# Altium schematic sheet CM5_HighSpeed.SchDoc
size 420 x 297 mm; Organization: Q-Wave Systems Co.,Ltd; Address1: No.1; Address2: Suksawat 33/1; Address3: Ratburana; Address4: Bangkok Thailand
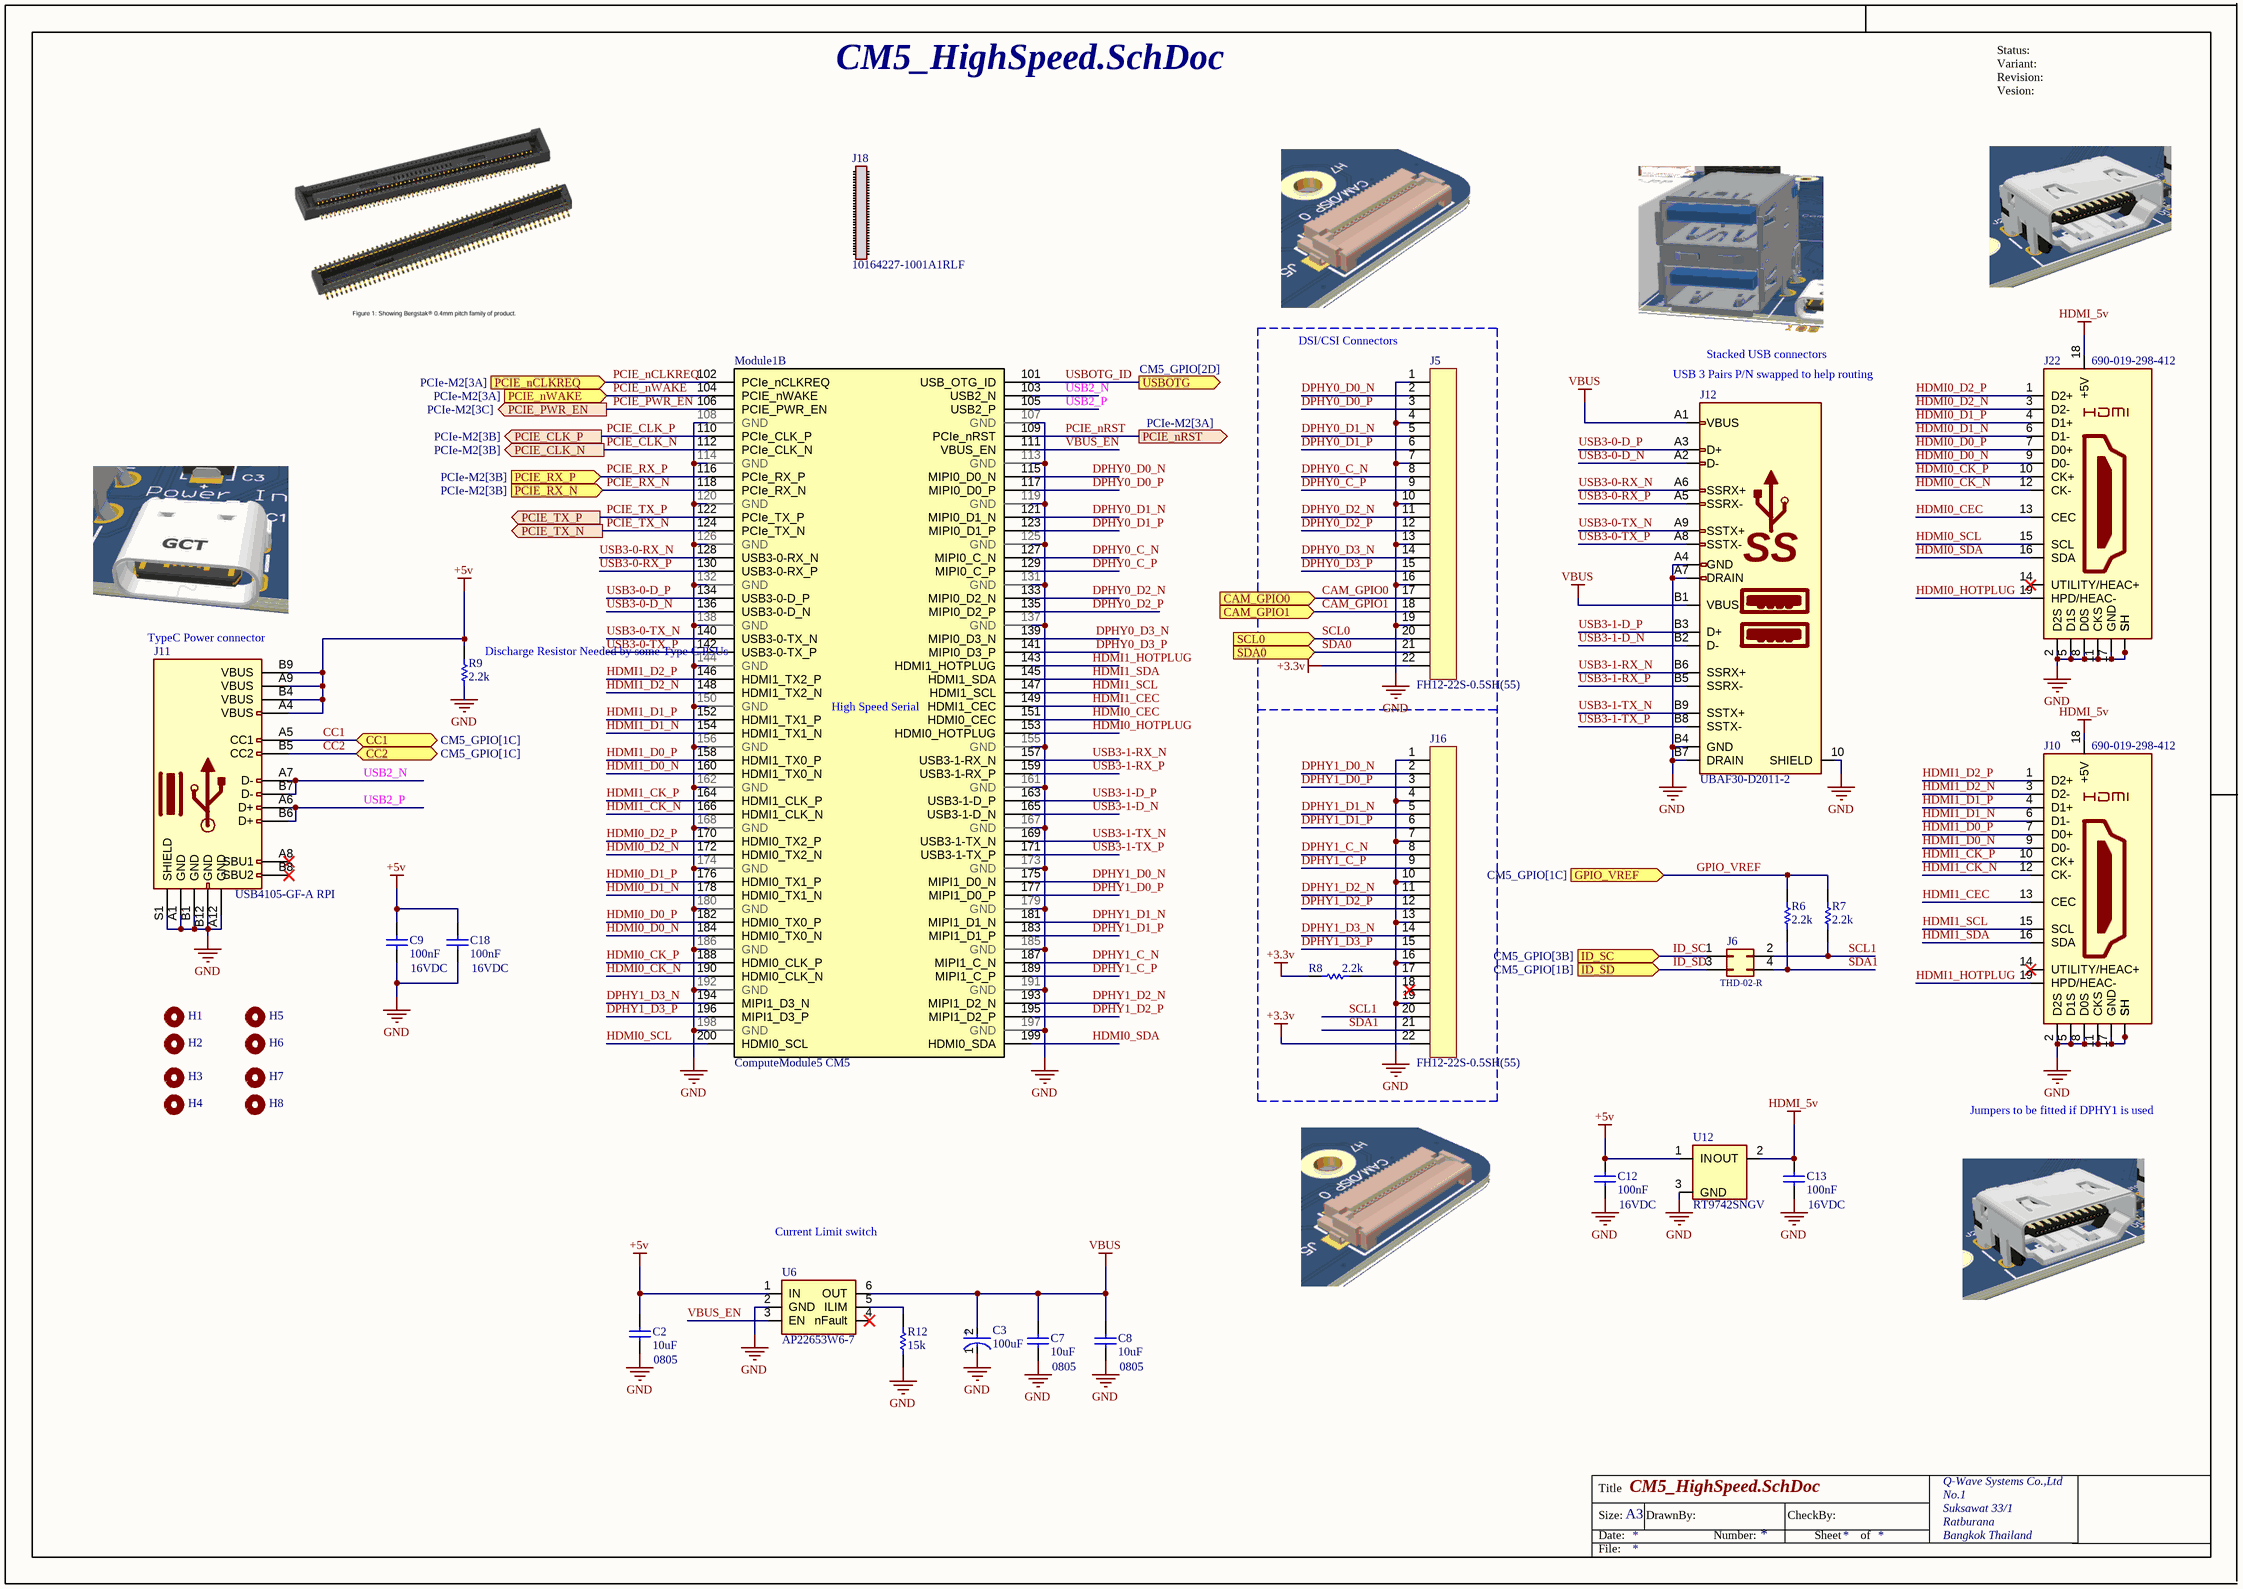
[diagram p0: CM5_HighSpeed.SchDoc]

## Parts
C2  value 10uF  Size: 0805  [WCAP-CSGP_0805_H=1.25mm]  (hidden comment: 10uF, 16V)
C3  value 100uF  [FP-CX-MFG]  (hidden comment: EEF-CX0J101R)
C7  value 10uF  Size: 0805  [WCAP-CSGP_0805_H=1.25mm]  (hidden comment: 10uF, 16V)
C8  value 10uF  Size: 0805  [WCAP-CSGP_0805_H=1.25mm]  (hidden comment: 10uF, 16V)
C9  value 100nF  Rated Voltage: 16VDC  [WCAP-CSGP_0402_H=0.5mm]  (hidden comment: 100nF, 16V)
C12  value 100nF  Rated Voltage: 16VDC  [WCAP-CSGP_0402_H=0.5mm]  (hidden comment: 100nF, 16V)
C13  value 100nF  Rated Voltage: 16VDC  [WCAP-CSGP_0402_H=0.5mm]  (hidden comment: 100nF, 16V)
C18  value 100nF  Rated Voltage: 16VDC  [WCAP-CSGP_0402_H=0.5mm]  (hidden comment: 100nF, 16V)
H1  MountingHole CMIO  [MountingHole CMIO]  (value not drawn)  (no BOM)
H2  MountingHole CMIO  [MountingHole CMIO]  (value not drawn)  (no BOM)
H3  MountingHole CMIO  [MountingHole CMIO]  (value not drawn)  (no BOM)
H4  MountingHole CMIO  [MountingHole CMIO]  (value not drawn)  (no BOM)
H5  MountingHole CMIO  [MountingHole CMIO]  (value not drawn)  (no BOM)
H6  MountingHole CMIO  [MountingHole CMIO]  (value not drawn)  (no BOM)
H7  MountingHole CMIO  [MountingHole CMIO]  (value not drawn)  (no BOM)
H8  MountingHole CMIO  [MountingHole CMIO]  (value not drawn)  (no BOM)
J5  FH12-22S-0.5SH(55)  [FH12-22S-0.5SH(55)]
J6  THD-02-R  [THD-02-R]
J10  690-019-298-412  [690-019-298-412]
J11  USB4105-GF-A RPI  [USB4105-GF-A RPI]
J12  UBAF30-D2011-2  [UBAF30-D2011-2]
J16  FH12-22S-0.5SH(55)  [FH12-22S-0.5SH(55)]
J18  10164227-1001A1RLF  [CM5-BergStak-10164227]
J22  690-019-298-412  [690-019-298-412]
Module1  ComputeModule5 CM5  [ComputeModule5-CM5]  (part B of 2)  (no BOM)
R6  value 2.2k  [SMD-0402-RES]  (hidden comment: RES SMD 2.2K OHM 1% 1/10W 0402)
R7  value 2.2k  [SMD-0402-RES]  (hidden comment: RES SMD 2.2K OHM 1% 1/10W 0402)
R8  value 2.2k  [SMD-0402-RES]  (hidden comment: RES SMD 2.2K OHM 1% 1/10W 0402)
R9  value 2.2k  [SMD-0402-RES]  (hidden comment: RES SMD 2.2K OHM 1% 1/10W 0402)
R12  value 15k  [SMD-0402-RES]  (hidden comment: RES SMD 15K OHM 1% 1/10W 0402)
U6  AP22653W6-7  [FP-SOT26-IPC_A]
U12  RT9742SNGV  [RT9742SNGV]

## Ports
CAM_GPIO0 (in, see CM5_GPIO[3C]), CAM_GPIO1 (in, see CM5_GPIO[1C]), CC1 (bidir, see CM5_GPIO[1C]), CC2 (bidir, see CM5_GPIO[1C]), GPIO_VREF (in, see CM5_GPIO[1C]), ID_SC (in, see CM5_GPIO[3B]), ID_SD (in, see CM5_GPIO[1B]), PCIE_CLK_N (out, see PCIe-M2[3B]), PCIE_CLK_P (out, see PCIe-M2[3B]), PCIE_nCLKREQ (in, see PCIe-M2[3A]), PCIE_nRST (out, see PCIe-M2[3A]), PCIE_nWAKE (in, see PCIe-M2[3A]), PCIE_PWR_EN (out, see PCIe-M2[3C]), PCIE_RX_N (in, see PCIe-M2[3B]), PCIE_RX_P (in, see PCIe-M2[3B]), PCIE_TX_N (out, see PCIe-M2[3A]), PCIE_TX_P (out, see PCIe-M2[3A]), SCL0 (in, see CM5_GPIO[1C]), SDA0 (in, see CM5_GPIO[1C]), USBOTG (out, see CM5_GPIO[2D])

## Nets
+3.3v: J5.22(Pin_22) J16.22(Pin_22) R8.1
+5v: C2.2 C9.2 C12.2 C18.2 J11.A4(VBUS) J11.A9(VBUS) J11.B4(VBUS) J11.B9(VBUS) R9.2 U6.1(IN) U12.1(IN)
GND: C2.1 C3.1(C) C7.1 C8.1 C9.1 C12.1 C13.1 C18.1 J5.1(Pin_1) J5.4(Pin_4) J5.7(Pin_7) J5.10(Pin_10) J5.13(Pin_13) J5.16(Pin_16) J5.19(Pin_19) J10.2(D2S) J10.5(D1S) J10.8(D0S) J10.11(CKS) J10.17(GND) J10.SH1(SH) J10.SH2(SH) J10.SH3(SH) J10.SH4(SH) J11.A1(GND) J11.A12(GND) J11.B1(GND) J11.B12(GND) J11.S1(SHIELD) J12.10(SHIELD) J12.A4(GND) J12.A7(DRAIN) J12.B4(GND) J12.B7(DRAIN) J16.1(Pin_1) J16.4(Pin_4) J16.7(Pin_7) J16.10(Pin_10) J16.13(Pin_13) J16.16(Pin_16) J16.19(Pin_19) J22.2(D2S) J22.5(D1S) J22.8(D0S) J22.11(CKS) J22.17(GND) J22.SH1(SH) J22.SH2(SH) J22.SH3(SH) J22.SH4(SH) Module1.107(GND) Module1.108(GND) Module1.113(GND) Module1.114(GND) Module1.119(GND) Module1.120(GND) Module1.125(GND) Module1.126(GND) Module1.131(GND) Module1.132(GND) Module1.137(GND) Module1.138(GND) Module1.144(GND) Module1.150(GND) Module1.155(GND) Module1.156(GND) Module1.161(GND) Module1.162(GND) Module1.167(GND) Module1.168(GND) Module1.173(GND) Module1.174(GND) Module1.179(GND) Module1.180(GND) Module1.185(GND) Module1.186(GND) Module1.191(GND) Module1.192(GND) Module1.197(GND) Module1.198(GND) R9.1 R12.2 U6.2(GND) U12.3(GND)
HDMI_5v: C13.2 J10.18(+5V) J22.18(+5V) U12.2(OUT)
VBUS: C3.2(A) C7.2 C8.2 J12.A1(VBUS) J12.B1(VBUS) U6.6(OUT)
CAM_GPIO0: J5.17(Pin_17) ; port CAM_GPIO0
CAM_GPIO1: J5.18(Pin_18) ; port CAM_GPIO1
CC1: J11.A5(CC1) ; port CC1
CC2: J11.B5(CC2) ; port CC2
DPHY0_C_N: J5.8(Pin_8) Module1.127(MIPI0_C_N)
DPHY0_C_P: J5.9(Pin_9) Module1.129(MIPI0_C_P)
DPHY0_D0_N: J5.2(Pin_2) Module1.115(MIPI0_D0_N)
DPHY0_D0_P: J5.3(Pin_3) Module1.117(MIPI0_D0_P)
DPHY0_D1_N: J5.5(Pin_5) Module1.121(MIPI0_D1_N)
DPHY0_D1_P: J5.6(Pin_6) Module1.123(MIPI0_D1_P)
DPHY0_D2_N: J5.11(Pin_11) Module1.133(MIPI0_D2_N)
DPHY0_D2_P: J5.12(Pin_12) Module1.135(MIPI0_D2_P)
DPHY0_D3_N: J5.14(Pin_14) Module1.139(MIPI0_D3_N)
DPHY0_D3_P: J5.15(Pin_15) Module1.141(MIPI0_D3_P)
DPHY1_C_N: J16.8(Pin_8) Module1.187(MIPI1_C_N)
DPHY1_C_P: J16.9(Pin_9) Module1.189(MIPI1_C_P)
DPHY1_D0_N: J16.2(Pin_2) Module1.175(MIPI1_D0_N)
DPHY1_D0_P: J16.3(Pin_3) Module1.177(MIPI1_D0_P)
DPHY1_D1_N: J16.5(Pin_5) Module1.181(MIPI1_D1_N)
DPHY1_D1_P: J16.6(Pin_6) Module1.183(MIPI1_D1_P)
DPHY1_D2_N: J16.11(Pin_11) Module1.193(MIPI1_D2_N)
DPHY1_D2_P: J16.12(Pin_12) Module1.195(MIPI1_D2_P)
DPHY1_D3_N: J16.14(Pin_14) Module1.194(MIPI1_D3_N)
DPHY1_D3_P: J16.15(Pin_15) Module1.196(MIPI1_D3_P)
GPIO_VREF: R6.2 R7.2 ; port GPIO_VREF
HDMI0_CEC: J22.13(CEC) Module1.151(HDMI0_CEC)
HDMI0_CK_N: J22.12(CK-) Module1.190(HDMI0_CLK_N)
HDMI0_CK_P: J22.10(CK+) Module1.188(HDMI0_CLK_P)
HDMI0_D0_N: J22.9(D0-) Module1.184(HDMI0_TX0_N)
HDMI0_D0_P: J22.7(D0+) Module1.182(HDMI0_TX0_P)
HDMI0_D1_N: J22.6(D1-) Module1.178(HDMI0_TX1_N)
HDMI0_D1_P: J22.4(D1+) Module1.176(HDMI0_TX1_P)
HDMI0_D2_N: J22.3(D2-) Module1.172(HDMI0_TX2_N)
HDMI0_D2_P: J22.1(D2+) Module1.170(HDMI0_TX2_P)
HDMI0_HOTPLUG: J22.19(HPD/HEAC-) Module1.153(HDMI0_HOTPLUG)
HDMI0_SCL: J22.15(SCL) Module1.200(HDMI0_SCL)
HDMI0_SDA: J22.16(SDA) Module1.199(HDMI0_SDA)
HDMI1_CEC: J10.13(CEC) Module1.149(HDMI1_CEC)
HDMI1_CK_N: J10.12(CK-) Module1.166(HDMI1_CLK_N)
HDMI1_CK_P: J10.10(CK+) Module1.164(HDMI1_CLK_P)
HDMI1_D0_N: J10.9(D0-) Module1.160(HDMI1_TX0_N)
HDMI1_D0_P: J10.7(D0+) Module1.158(HDMI1_TX0_P)
HDMI1_D1_N: J10.6(D1-) Module1.154(HDMI1_TX1_N)
HDMI1_D1_P: J10.4(D1+) Module1.152(HDMI1_TX1_P)
HDMI1_D2_N: J10.3(D2-) Module1.148(HDMI1_TX2_N)
HDMI1_D2_P: J10.1(D2+) Module1.146(HDMI1_TX2_P)
HDMI1_HOTPLUG: J10.19(HPD/HEAC-) Module1.143(HDMI1_HOTPLUG)
HDMI1_SCL: J10.15(SCL) Module1.147(HDMI1_SCL)
HDMI1_SDA: J10.16(SDA) Module1.145(HDMI1_SDA)
ID_SC: J6.1(Pin_1) ; port ID_SC
ID_SD: J6.3(Pin_3) ; port ID_SD
PCIE_CLK_N: Module1.112(PCIe_CLK_N) ; port PCIE_CLK_N
PCIE_CLK_P: Module1.110(PCIe_CLK_P) ; port PCIE_CLK_P
PCIE_nCLKREQ: Module1.102(PCIe_nCLKREQ) ; port PCIE_nCLKREQ
PCIE_nRST: Module1.109(PCIe_nRST) ; port PCIE_nRST
PCIE_nWAKE: Module1.104(PCIE_nWAKE) ; port PCIE_nWAKE
PCIE_PWR_EN: Module1.106(PCIE_PWR_EN) ; port PCIE_PWR_EN
PCIE_RX_N: Module1.118(PCIe_RX_N) ; port PCIE_RX_N
PCIE_RX_P: Module1.116(PCIe_RX_P) ; port PCIE_RX_P
PCIE_TX_N: Module1.124(PCIe_TX_N) ; port PCIE_TX_N
PCIE_TX_P: Module1.122(PCIe_TX_P) ; port PCIE_TX_P
SCL0: J5.20(Pin_20) ; port SCL0
SCL1: J6.2(Pin_2) J16.20(Pin_20) R7.1
SDA0: J5.21(Pin_21) ; port SDA0
SDA1: J6.4(Pin_4) J16.21(Pin_21) R6.1
USB2_N: J11.A7(D-) J11.B7(D-) Module1.103(USB2_N)
USB2_P: J11.A6(D+) J11.B6(D+) Module1.105(USB2_P)
USB3-0-D_N: J12.A2(D-) Module1.136(USB3-0-D_N)
USB3-0-D_P: J12.A3(D+) Module1.134(USB3-0-D_P)
USB3-0-RX_N: J12.A6(SSRX+) Module1.128(USB3-0-RX_N)
USB3-0-RX_P: J12.A5(SSRX-) Module1.130(USB3-0-RX_P)
USB3-0-TX_N: J12.A9(SSTX+) Module1.140(USB3-0-TX_N)
USB3-0-TX_P: J12.A8(SSTX-) Module1.142(USB3-0-TX_P)
USB3-1-D_N: J12.B2(D-) Module1.165(USB3-1-D_N)
USB3-1-D_P: J12.B3(D+) Module1.163(USB3-1-D_P)
USB3-1-RX_N: J12.B6(SSRX+) Module1.157(USB3-1-RX_N)
USB3-1-RX_P: J12.B5(SSRX-) Module1.159(USB3-1-RX_P)
USB3-1-TX_N: J12.B9(SSTX+) Module1.169(USB3-1-TX_N)
USB3-1-TX_P: J12.B8(SSTX-) Module1.171(USB3-1-TX_P)
USBOTG_ID: Module1.101(USB_OTG_ID) ; port USBOTG
VBUS_EN: Module1.111(VBUS_EN) U6.3(EN)
NetJ16_17: J16.17(Pin_17) R8.2
NetR12_1: R12.1 U6.5(ILIM)

Not connected (* = marked no-connect by the designer): J10 14(UTILITY/HEAC+)*; J11 A8(SBU1)* B8(SBU2)*; J16 18(Pin_18)*; J22 14(UTILITY/HEAC+)*; U6 4(nFault)*

## Notes on the sheet
- (near J5) DSI/CSI Connectors
- (near J12) USB 3 Pairs P/N swapped to help routing
- Stacked USB connectors
- (near J11) TypeC Power connector
- (near Module1) Discharge Resistor
  Needed by some
  Type C PSUs
- Jumpers to be fitted if DPHY1 is used
- Current Limit switch
- Status:
- Revision:
- Variant:
- Vesion:
- Title
- Size:
- Date:
- A3
- DrawnBy:
- Number:
- CheckBy:
- Sheet
- of
- File:
- (in symbol CMP-002-00176-3) SS
- (in symbol CMP-000464-1) +
- (in symbol CMP-633-000139-6, part B) High Speed Serial

## Library data of the parts
C2 C7 C8 = CMP-01449-2: WCAP-CSGP Multilayer Ceramic Chip Capacitor, General Purpose, size 0805, X5R, 10uF, 16V; Manufacturer: Wurth Elektronik; Manufacturer Part Number: 885012107014; Isolation Resistance  min.: 0.01GOhm; Dissipation Factor max.: 10%; Capacitance Tolerance: +/-20%; Technical Reference: X5R0805106M016DFCT10000; Rated Voltage: 16VDC; Packaging: Tape and Reel; ComponentLink2URL: https://www.we-online.com/catalog/datasheet/885012107014.pdf; Height: 1.25mm; Source: WCAP-CSGP_0805.SchLib; Design Item ID: 885012107014; ComponentLink2Description: Datasheet; Pin Count: 2; Capacitance: 10uF; ComponentLink1URL: http://www.we-online.de; Operating Temperature: -55 to +85degC; Published Date: April 2021; Mounting Technology: SMT; Ceramic Type: X5R; ComponentLink1Description: Manufacturer; Component Type: Standard; Q-Factor min.: -
C3 = CMP-000464-1: Cap Aluminum 100uF 6.3V 20% (7.3 X 4.3 X 1.9mm) SMD 0.015 Ohm 2700mA 1000h 105C Embossed T/R; Leakage Current: 63uA; Lead Diameter: 2.4mm; Life (Hours): 1000Hour; Dissipation Factor: 0.06%; Ripple Current: 2.7A; ESR (Equivalent Series Resistance): 15mR; Max Operating Temperature: 105°C; Lead Free: Lead Free; RoHS Compliant: Yes; Voltage Rating: 6.3V; Depth: 4.3mm; Reach SVHC Compliant: No; Package Quantity: 3500; Tolerance: 20%; Construction: Flat; Length: 7.3mm; Pins: 2; Width: 4.3mm; Case/Package: 2917; Height: 1.9mm; Packaging: Tape and Reel; Lead Pitch: 1.3mm; Mounting Technology: Surface Mount,PCB; Voltage: 6.3V; Termination: SMD/SMT; Ripple Current (AC): 2.7A; Weight: 0.004586oz; Case Code (Metric): 7343; Radiation Hardening: No; Voltage Rating (DC): 6.3V; Series: SP-Cap CX; Min Operating Temperature: -40°C; Case Code (Imperial): 2917
C9 C12 C13 C18 = CMP-01409-2: WCAP-CSGP Multilayer Ceramic Chip Capacitor, General Purpose, size 0402, X5R, 100nF, 16V; Manufacturer Part Number: 885012105016; Manufacturer: Wurth Elektronik; Technical Reference: X5R0402104M016DFCT10000; Isolation Resistance  min.: 5GOhm; Dissipation Factor max.: 5%; Capacitance Tolerance: +/-20%; Published Date: April 2021; Height: 0.5mm; Operating Temperature: -55 to +85degC; Source: WCAP-CSGP_0402.SchLib; Packaging: Tape and Reel; Q-Factor min.: -; Component Type: Standard; Capacitance: 100nF; Ceramic Type: X5R; ComponentLink1Description: Manufacturer; ComponentLink1URL: http://www.we-online.de; ComponentLink2URL: https://www.we-online.com/catalog/datasheet/885012105016.pdf; Pin Count: 2; Size: 0402; Mounting Technology: SMT; Design Item ID: 885012105016; ComponentLink2Description: Datasheet
H1-H8 = CMP-00028-00023-1
J5 J16 = CMP-002-00175-3: Connectors for Connecting - 0.5/1-mm Pitch FPC/FFC - FH12 Series (HIROSE ELECTRIC); Mating Cycles: 20; Insulation Resistance: 500MR; Number of Contacts: 22; Contact Resistance: 50mR; Current Rating: 500mA; Voltage Rating: 50V; Gender: Female; Pitch: 0.5mm; Max Current Rating: 400mA; Wire/Cable Type: Straight; Contact Location: Bottom; Actuator Material: Polyphenylene; Contact Plating: Gold; Mounting Technology: Surface Mount,Horizontal; Number of Positions: 22; Max Operating Temperature: 85°C; Packaging: Tape and Reel; Package Quantity: 2000; Width: 15.1mm; Length: 15.1mm; Lead Pitch: 0.5mm; RoHS Compliant: Yes; Max Voltage Rating (AC): 50V; Depth: 5.6mm; Lead Free: Lead Free; Series: FH12; Reach SVHC Compliant: No; Radiation Hardening: No; Material: Polyamide; Orientation: Right Angle; Contact Material: Bronze; Min Operating Temperature: -40°C; Housing Color: Beige; Flammability Rating: UL94 V-0; Number of Rows: 1; Color: Beige,Brown; Voltage Rating (AC): 50V; Housing Material: Polyamide; Termination: Solder
J6 = CMP-002-00174-1: PinHeader 2x02 P2.54mm Vertical; Manufacturer: Wurth Elektronik; Manufacturer Part Number: 61300421121; Rated Current: 3A; Pin Number: 4; Row Number: Dual; Withstanding Voltage: 500VAC; Pitch: 2.54mm; Contact Resistance: 20mOhm; Working Voltage: 250VAC; Value: 4; Gender: Pin Header; Published Date: May 2020; ComponentLink1Description: Manufacturer; Mounting Technology: THT; Orientation: Vertical; ComponentLink1URL: http://www.we-online.de; ComponentLink2Description: Datasheet; Pin Count: 4; ComponentLink2URL: https://www.we-online.com/catalog/datasheet/61300421121.pdf; Operating Temperature: -40 to +105degC; Component Type: Standard; Packaging: Bag; Source: WR-PHD_Pin Header_2.54mm.SchLib; Design Item ID: 61300421121
J10 J22 = CMP-135-000008-2: Connector: HDMI; socket; PIN: 19; gold-plated; Body coating: tinned; EDAC ALT P/N: 694D119-664-011; EDAC Link: https://edac.net/series/694d
J11 = CMP-002-00177-3: Conn USB 2.0 Type C RCP 24 POS 0.3mm/0.5mm Solder RA SMD 24 Terminal 1 Port T/R; Voltage Rating: 20V; Gender: Receptacle; USB Standard: USB 2.0; Shielding: Shielded; Number of Ports: 1; Number of Contacts: 16; Mating Cycles: 10000; Contact Material: Nickel,Gold; Series: USB4105; Height: 3.46mm; Min Operating Temperature: -40°C; Max Operating Temperature: 85°C; Contact Plating: Gold; Connector Type: USB; Mounting Technology: Surface Mount,Through Hole,Horizontal; Termination: Solder; Flammability Rating: UL94 V-0; Insulation Color: Black
J12 = CMP-002-00176-3: Conn USB 3.0 Type A RCP 18 POS 2mm/2mm Solder RA Thru-Hole 18 Terminal 2 Port T/R; Number of Contacts: 18; Shielding: Shielded; Gender: Receptacle; Number of Ports: 2; USB Standard: USB 3.0; Mating Cycles: 5000; Lead Free: Lead Free; Orientation: Right Angle; Connector Type: USB; Mounting Technology: Through Hole,Horizontal; Min Operating Temperature: -55°C; Max Operating Temperature: 85°C; Series: USB1100; RoHS Compliant: Yes; Contact Material: Copper Alloy,Copper; Termination: Solder; Flammability Rating: UL94 V-0; Reach SVHC Compliant: No; Insulation Color: Blue; Contact Plating: Gold; MT Link: https://www.mtconntech.com/double-deck-usb-af-3-0-type-90-degree-dip-type-connector-product/
J18 = CMP-634-000024-1: CM5 1.5mm Height 0.4MM Btb, 100P, Receptacle, 1.5MM Stack Height
Module1 = CMP-633-000139-6: Raspberry Pi Compute Module 5
R6-R9 = CMP-236-000428-2: Part Number: ERJ-2RKF2201X; Manufacturer: Panasonic Electronic Components; Power (Watts): 0.1W, 1/10W; Factory Stock: 0; Temperature Coefficient: ±100ppm/°C; Minimum Quantity: 1; @ qty: 1500; Unit Price (USD): 0.00496; Supplier Device Package: 0402; Height - Seated (Max): 0.016" (0.40mm); Tolerance: ±1%; Composition: Thick Film; Features: Automotive AEC-Q200; Datasheets: http://industrial.panasonic.com/www-cgi/jvcr13pz.cgi?E+PZ+3+AOA0002+ERJ2RKF2201X+7+WW; Size / Dimension: 0.039" L x 0.020" W (1.00mm x 0.50mm); Series: ERJ; Digi-Key Part Number: P2.20KLCT-ND; Image: //media.digikey.com/Photos/Panasonic%20Photos/ERJ-PA2-Series.jpg; Operating Temperature: -55°C ~ 155°C; Part Status: Active; Failure Rate: -; Quantity Available: 301785; Number of Terminations: 2; Packaging: Cut Tape (CT); Package / Case: 0402 (1005 Metric)
R12 = CMP-236-000339-2: Part Number: ERJ-2RKF1502X; Manufacturer: Panasonic Electronic Components; Unit Price (USD): 0.00496; Temperature Coefficient: ±100ppm/°C; Power (Watts): 0.1W, 1/10W; Factory Stock: 0; @ qty: 1500; Minimum Quantity: 1; Digi-Key Part Number: P15.0KLCT-ND; Package / Case: 0402 (1005 Metric); Size / Dimension: 0.039" L x 0.020" W (1.00mm x 0.50mm); Height - Seated (Max): 0.016" (0.40mm); Series: ERJ; Composition: Thick Film; Image: //media.digikey.com/Photos/Panasonic%20Photos/ERJ-PA2-Series.jpg; Supplier Device Package: 0402; Datasheets: http://industrial.panasonic.com/www-cgi/jvcr13pz.cgi?E+PZ+3+AOA0002+ERJ2RKF1502X+7+WW; Packaging: Cut Tape (CT); Features: Automotive AEC-Q200; Part Status: Active; Number of Terminations: 2; Failure Rate: -; Operating Temperature: -55°C ~ 155°C; Quantity Available: 1023884; Tolerance: ±1%
U6 = CMP-000465-1: USB Power High Side Switch Single 3V to 5.5V 2.1A 6-Pin SOT-26 T/R; Interface: On/Off; Number of Outputs: 1; Fault Protection: Over Voltage,Over Temperature,Short Circuit,Reverse Current; Output Configuration: High Side; Min Operating Temperature: -40°C; Output Current: 2.1A; Case/Package: SOT-23-6; Max Supply Voltage: 5.5V; Height: 1.4mm; Series: -; Number of Channels: 1; Max Output current: 2.1A; Min Supply Voltage: 3V; Max Operating Temperature: 85°C; Mounting Technology: Surface Mount
U12 = CMP-000463-1: IC Pwr Switch N-chan 1: 1 SOT23-3; Number of Outputs: 1; Fault Protection: Over Temperature,Reverse Current; Interface: On/Off; Output Configuration: High Side; Max Output current: 500mA; Packaging: Cut Tape; Max Operating Temperature: 85°C; Series: -; Case/Package: SOT-23-3; Min Operating Temperature: -40°C; Mounting Technology: Surface Mount; RoHS Compliant: Yes